# EAGLE design Sensor (EAGLE 7.2.0)
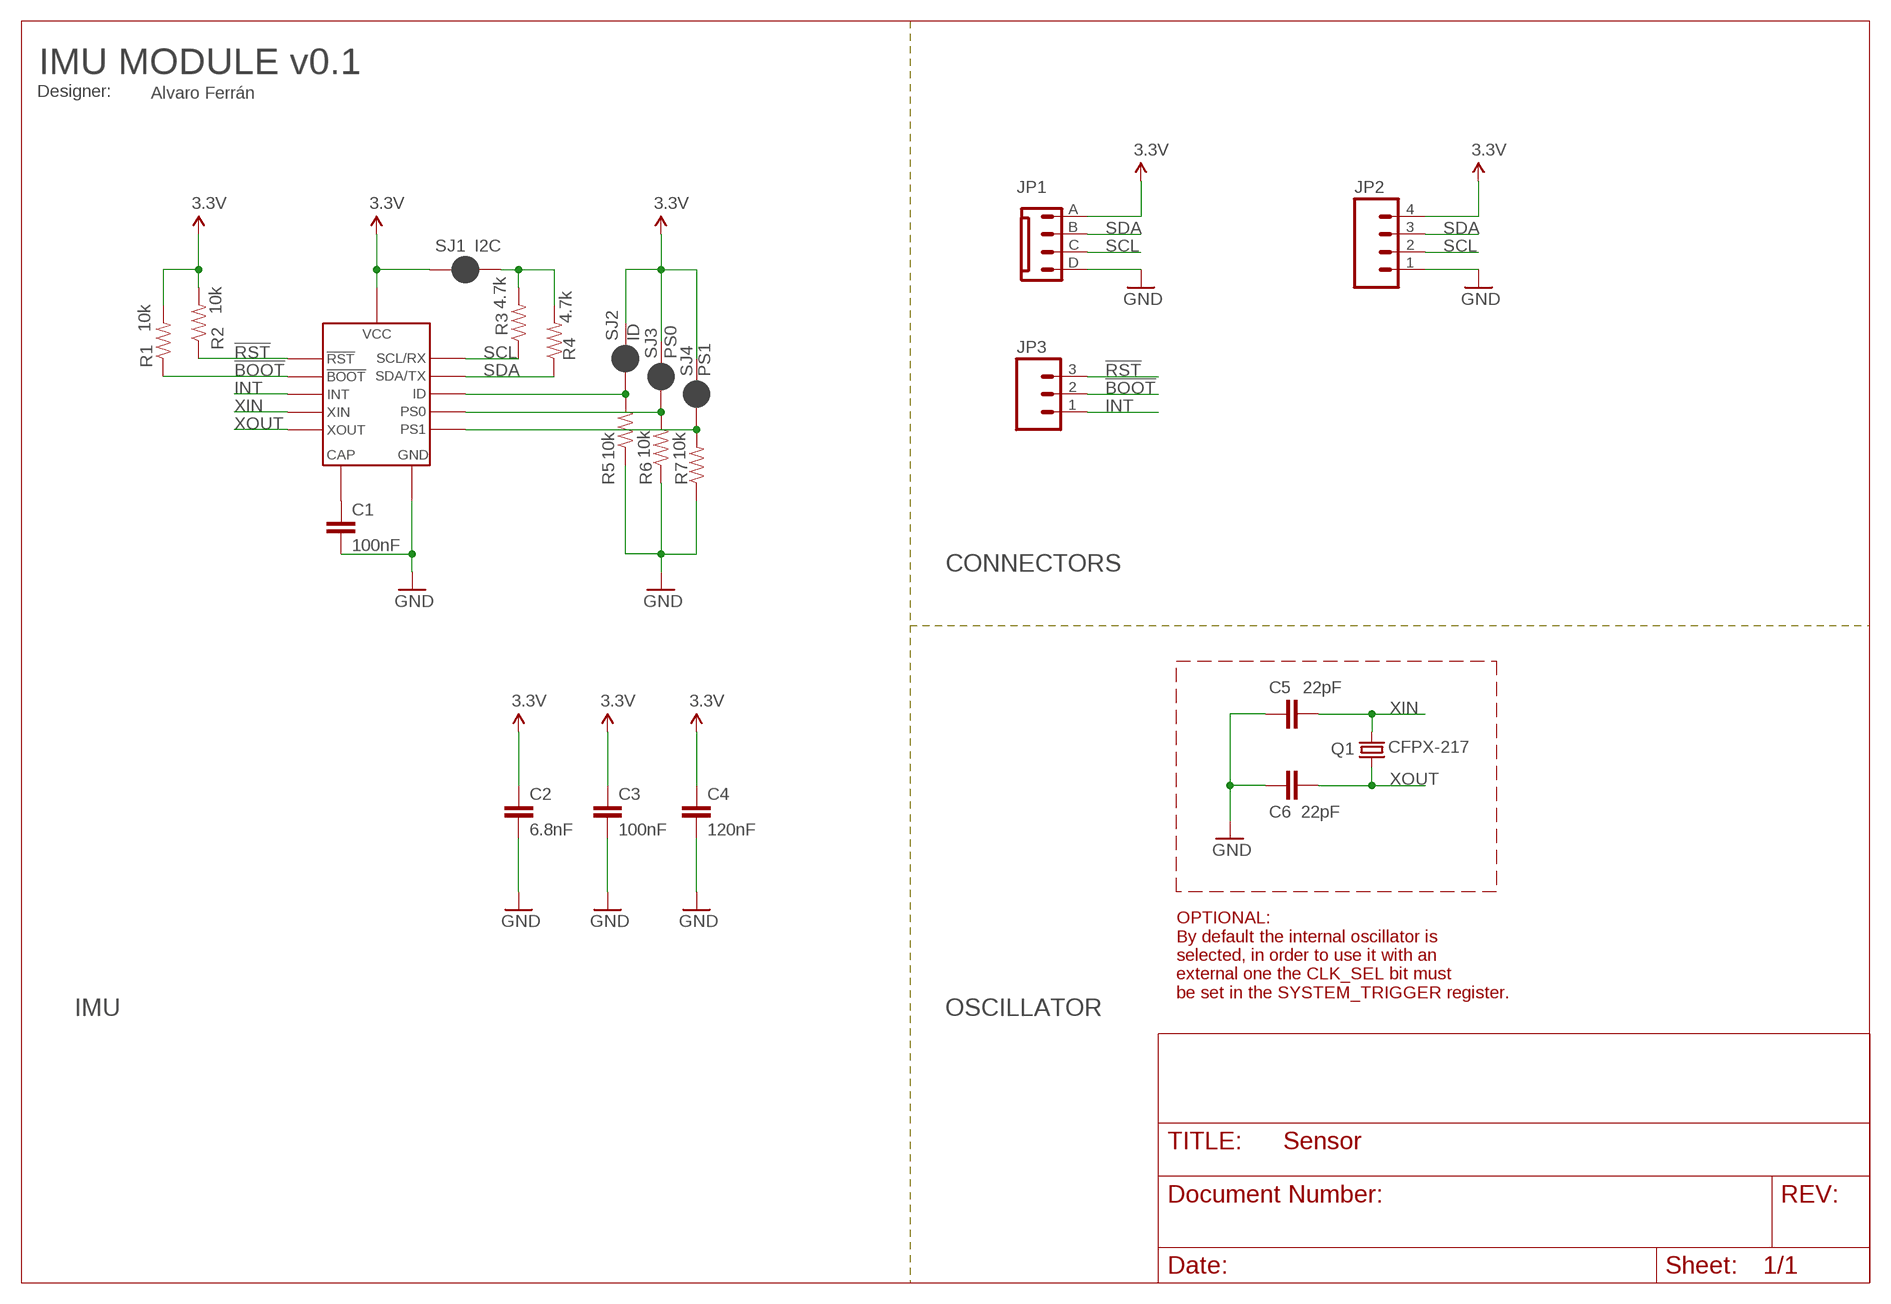
[diagram p0: schematic, sheet 1]

## Parts
C1  100nF  CAP0603-CAP  [0603-CAP]
C2  6.8nF  CAP0603-CAP  [0603-CAP]
C3  100nF  CAP0603-CAP  [0603-CAP]
C4  120nF  CAP0603-CAP  [0603-CAP]
C5  22pF  CAP0402-CAP  [0402-CAP]
C6  22pF  CAP0402-CAP  [0402-CAP]
JP1  MX-6410-04A  [MX-6410-04A]
JP2  M04LOCK  [1X04_LOCK]
JP3  M03LOCK  [1X03_LOCK]
Q1  CFPX-217  [CFPX-217]
R1  10k  RESISTOR0402-RES  [0402-RES]
R2  10k  RESISTOR0402-RES  [0402-RES]
R3  4.7k  RESISTOR0402-RES  [0402-RES]
R4  4.7k  RESISTOR0402-RES  [0402-RES]
R5  10k  RESISTOR0402-RES  [0402-RES]
R6  10k  RESISTOR0402-RES  [0402-RES]
R7  10k  RESISTOR0402-RES  [0402-RES]
SJ1  I2C  JUMPER-PAD-2-NC_BY_PASTE  [PAD-JUMPER-2-NC_BY_PASTE_YES_SILK]
SJ2  ID  JUMPER-PAD-2-NC_BY_PASTE  [PAD-JUMPER-2-NC_BY_PASTE_YES_SILK]
SJ3  PS0  JUMPER-PAD-2-NC_BY_PASTE  [PAD-JUMPER-2-NC_BY_PASTE_YES_SILK]
SJ4  PS1  JUMPER-PAD-2-NC_BY_PASTE  [PAD-JUMPER-2-NC_BY_PASTE_YES_SILK]
U1  BNO055  [BNO055]

## Nets
3.3V: C2.1 C3.1 C4.1 JP1.A JP2.4 R1.2 R2.2 SJ1.2 SJ2.2 SJ3.2 SJ4.2 U1.3(VCC) U1.28(VCC)
!BOOT: JP3.2 R1.1 U1.4(BOOT)
!RST: JP3.3 R2.1 U1.11(RST)
GND: C1.2 C2.2 C3.2 C4.2 C5.1 C6.1 JP1.D JP2.1 R5.1 R6.1 R7.1 U1.2(GND) U1.10(GND) U1.15(GND) U1.16(GND) U1.18(GND) U1.25(GND)
INT: JP3.1 U1.14(INT)
N$1: C1.1 U1.9(CAP)
N$2: R3.2 R4.2 SJ1.1
N$4: R5.2 SJ2.1 U1.17(ID)
N$5: R6.2 SJ3.1 U1.6(PS0)
N$6: R7.2 SJ4.1 U1.5(PS1)
SCL: JP1.C JP2.2 R3.1 U1.19(SCL/RX)
SDA: JP1.B JP2.3 R4.1 U1.20(SDA/TX)
XIN: C5.2 Q1.2 U1.27(XIN)
XOUT: C6.2 Q1.1 U1.26(XOUT)

## Notes on the sheet
- IMU MODULE v0.1
- Designer: | Alvaro Ferrán
- CONNECTORS
- OPTIONAL:
  By default the internal oscillator is
  selected, in order to use it with an
  external one the CLK_SEL bit must 
  be set in the SYSTEM_TRIGGER register.
- IMU | OSCILLATOR

## Library data of the parts
C1-C6 = SparkFun-Passives:CAP: Capacitor Standard 0603 ceramic capacitor, and 0.1" leaded capacitor.
JP1 = alvaroferran:MX-6410-04A: Locking molex connector ( http://www.tme.eu/en/details/mx-6410-04a/raster-signal-connectors-254mm/molex/0022272041-ae-6410-04a102/ )
JP2 = SparkFun-Connectors:M04: Header 4 Standard 4-pin 0.1" header. Use with straight break away headers (SKU : PRT-00116), right angle break away headers (PRT-00553), swiss pins (PRT-00743), machine pins (PRT-00117), and female headers (PRT-00115). Molex polarized connector foot print use with SKU : PRT-08231 with associated crimp pins and housings. 1MM SMD Version SKU: PRT-10208
JP3 = SparkFun-Connectors:M03: Header 3 Standard 3-pin 0.1" header. Use with straight break away headers (SKU : PRT-00116), right angle break away headers (PRT-00553), swiss pins (PRT-00743), machine pins (PRT-00117), and female headers (PRT-00115). Molex polarized connector foot print use with SKU : PRT-08232 with associated crimp pins and housings.
Q1 = alvaroferran:CFPX-217
R1-R7 = SparkFun-Passives:RESISTOR: Resistor Basic schematic elements and footprints for 0603, 1206, and PTH resistors.
SJ1-SJ4 = SparkFun-Passives:JUMPER-PAD-2-NC_BY_PASTE
U1 = alvaroferran:BNO055: The BNO055 is a System in Package (SiP), integrating a triaxial 14-bit accelerometer, a triaxial 16-bit gyroscope with a range of ±2000 degrees per second, a triaxial geomagnetic sensor and a 32-bit microcontroller running the company’s BSX3.0 FusionLib software. At just 5.2 x 3.8 x 1.1 mm3, it is significantly smaller than comparable discrete or system-on-board solutions.

## Net classes
0 default: width 0.254 mm, drill 0.254 mm, clearance 0.203 mm
1 power: width 0.61 mm, drill 0.61 mm, clearance 0.254 mm

## Board
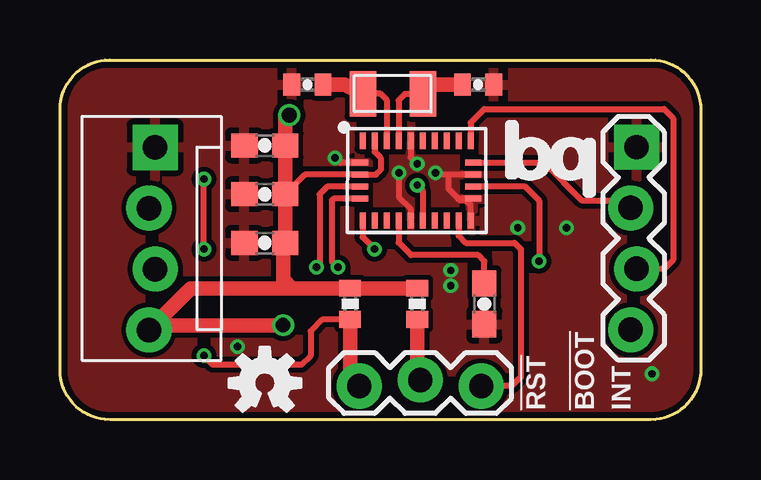
[diagram p1: board, top side]
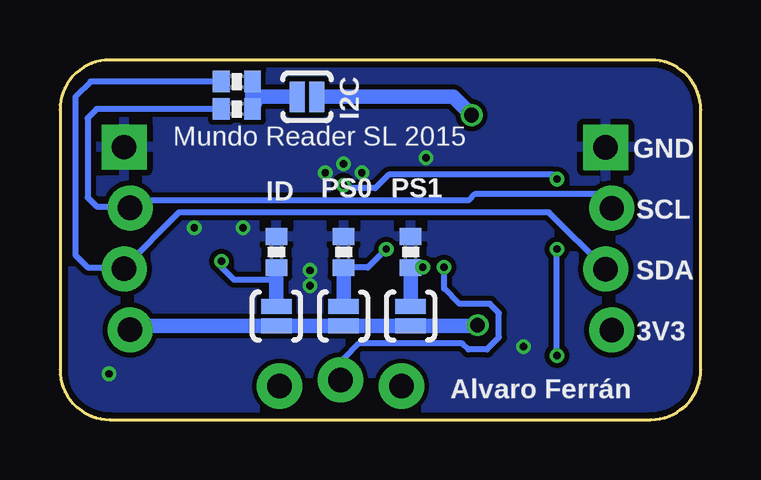
[diagram p2: board, bottom side, seen from below]

Size 26.7 x 15 mm. Coordinates in mm from the lower left corner, seen from the top.
Outline: 0,2.07 0,12.93 arc-90 2.07,15 24.62,15 arc-90 26.7,12.93 26.7,2.07 arc-90 24.62,0 2.07,0 arc-90 0,2.07
Copper layers (1*16): Top 0.035mm / dielectric 1.5mm / Bottom 0.035mm
Design rules "pighixxx_CAM_DRC_V1.0": minimum track width 6mil, minimum drill 12mil, track to track 6mil, track to pad 6mil, pad to pad 6mil, via to via 6mil, smd to smd 0mil, copper to edge 10mil, drill to drill 10mil, minimum pad ring 10mil, minimum via ring 6mil, stop-mask expansion 2mil, vias tented up to drill 100mil, thermal gap 10mil

### Footprints (pad centres in the part's own frame; a part is rotated, then mirrored left to right if it is on the bottom)
0603-CAP = smd 1.1 x 1: 1 -0.85,0; 2 0.85,0
0402-CAP = smd 0.7 x 0.9: 1 -0.65,0; 2 0.65,0
MX-6410-04A = drill 1.016 pad 1.88: A 8.9,2.797; B 6.36,3.051; C 3.82,2.797 | drill 1.016 pad 1.88 square: D 1.28,3.051
1X04_LOCK = drill 1.016 pad 1.88 square: 1 0,0.127 | drill 1.016 pad 1.88: 2 2.54,-0.127; 3 5.08,0.127; 4 7.62,-0.127
1X03_LOCK = drill 1.016 pad 1.88: 1 0,0.127; 2 2.54,-0.127; 3 5.08,0.127
CFPX-217 = smd 1.1 x 1.9: 1 -1.25,0; 2 1.25,0
0402-RES = smd 0.7 x 0.9: 1 -0.65,0; 2 0.65,0
PAD-JUMPER-2-NC_BY_PASTE_YES_SILK = smd 0.635 x 1.27: 1 -0.401,0; 2 0.413,0
BNO055 = smd 0.25 x 0.68: 1 -2.279,1.72; 6 -2.279,-1.606; 7 -1.779,-1.606; 8 -1.279,-1.606; 9 -0.779,-1.606; 10 -0.279,-1.606; 11 0.221,-1.606; 12 0.721,-1.606; 13 1.221,-1.606; 14 1.721,-1.606; 15 2.221,-1.606; 20 2.221,1.72; 21 1.721,1.72; 22 1.221,1.72; 23 0.721,1.72; 24 0.221,1.72; 25 -0.279,1.72; 26 -0.779,1.72; 27 -1.279,1.72; 28 -1.779,1.72 | smd 0.68 x 0.25: 2 -2.387,0.809; 3 -2.387,0.309; 4 -2.387,-0.191; 5 -2.387,-0.691; 16 2.332,-0.692; 17 2.332,-0.192; 18 2.332,0.308; 19 2.332,0.808

### Placement (x,y rotation side)
C1  17.68,4.83 270 top
C2  8.53,11.43 180 top
C3  8.53,9.4 180 top
C4  8.53,7.37 180 top
C5  10.31,13.97 0 top
C6  17.42,13.97 180 top
JP1  0.91,12.64 270 top
JP2  23.9,11.37 270 top
JP3  17.55,1.52 180 top
Q1  13.87,13.59 180 top
R1  14.88,4.83 90 top
R2  12.09,4.83 90 top
R3  19.33,12.95 0 bottom
R4  19.33,14.1 0 bottom
R5  17.68,6.98 270 bottom
R6  14.88,6.98 270 bottom
R7  12.09,6.98 270 bottom
SJ1  16.41,13.46 0 bottom
SJ2  17.68,4.32 270 bottom
SJ3  14.88,4.32 270 bottom
SJ4  12.09,4.32 270 bottom
U1  14.88,9.91 0 top
U$1  [BQ_LOGO_MEDIUM]  18.57,9.27 0 top
U$2  [OSHW-LOGO-S]  8.53,1.52 0 top

### Tracks (layer width: path | path; a pad name or v marks a point on that pad's centre or on a via)
3.3V  (via drill 0.61)
  Top 0.254: C3.1 10.2,10.21 U1.3 13.16,10.21 13.36,10.41 13.36,10.92 13.1,11.18 U1.28
  Top 0.61: 9.66,5.48 R2.2 R1.2 | 9.66,5.48 9.3,5.84 9.3,7.28 C4.1 C3.1 C2.1 9.38,12.53 v9.55,12.7 | 9.66,5.48 5.45,5.48 JP1.A 3.91,3.94 v9.3,3.94
  Bottom 0.61: SJ1.2 10.31,13.46 v9.55,12.7 | 3.88,3.9 JP1.A | v9.3,3.94 9.3,3.9 SJ4.2 SJ3.2 SJ2.2 23.61,3.9 JP2.4
!BOOT  (via drill 0.3)
  Top 0.254: v10.69,6.35 arc60 10.82,6.6 10.82,9.4 11.14,9.71 U1.4
  Top 0.61: R1.1 14.88,1.78 JP3.2
  Bottom 0.254: v10.69,6.35 10.69,5.46 10.06,4.83 8.79,4.83 8.41,4.44 8.41,3.43 8.91,2.92 9.68,2.92 9.93,3.17 14.25,3.17 14.88,2.54 14.88,1.78 JP3.2
!RST  (via drill 0.3)
  Top 0.254: R2.1 10.93,4.18 10.44,3.68 10.44,2.67 10.06,2.29 6.37,2.29 v5.99,2.67 | v5.99,7.11 v5.99,10.03 | v14.88,9.78 15.1,9.56 U1.11
  Top 0.61: R2.1 12.09,1.78 JP3.3
  Bottom 0.254: v5.99,2.67 v5.99,7.11 | v5.99,10.03 6.15,10.21 13,10.21 13.56,9.65 14.5,9.65 14.76,9.78 v14.88,9.78
GND  (via drill 0.3)
  Top 0.254: U1.15 17.1,8.95 16.92,9.14 16.66,9.14 16.73,9.21 U1.16 16.59,9.21 16.18,9.63 16.18,10.21 | U1.18 16.18,10.21 | 16.18,10.21 15.72,10.21 v15.65,10.29 | U1.25 14.6,10.95 v14.88,10.67 | U1.2 11.66,10.71 v11.45,10.92 | v14.12,10.29 14.12,9.27 14.6,8.79 U1.10
  other vias: 19.07,8 21.11,8 16.28,6.22 16.28,5.59 7.39,3.05 24.66,1.9
  pour Top: 26.82,14.99 26.82,-0.25 -0.36,-0.25 -0.36,14.99
  pour Bottom: 26.82,14.99 26.82,-0.25 -0.36,-0.25 -0.36,14.99
INT
  Top 0.254: JP3.1 18.82,1.4 19.2,1.78 19.2,7.11 18.95,7.37 16.92,7.37 16.6,7.68 U1.14
N$1
  Top 0.254: U1.9 14.1,7.38 14.63,6.86 17.42,6.86 17.68,6.6 C1.1
N$2
  Bottom 0.61: R4.2 R3.2 18.42,13.46 SJ1.1
N$4  (via drill 0.3)
  Top 0.254: v19.96,6.6 19.96,9.14 19.39,9.71 U1.17
  Bottom 0.254: v19.96,6.6 19.96,6.35 19.46,5.84 17.68,5.84
  Bottom 0.61: SJ2.1 17.68,5.84 R5.2
N$5  (via drill 0.3)
  Top 0.254: v13.11,7.11 12.6,7.61 U1.6
  Bottom 0.254: v13.11,7.11 13.88,6.33 R6.2
  Bottom 0.61: SJ3.1 R6.2
N$6  (via drill 0.3)
  Top 0.254: v11.58,6.35 11.33,6.6 11.33,9.14 11.4,9.21 U1.5
  Bottom 0.254: v11.58,6.35 12.07,6.35 R7.2
  Bottom 0.61: R7.2 SJ4.1
SCL
  Top 0.254: U1.19 20.17,10.71 21.74,9.14 23.46,9.14 JP2.2
  Bottom 0.254: JP1.C 4.29,9.4 9.42,9.4 9.68,9.14 23.46,9.14 JP2.2 23.84,8.89 25.17,8.89 25.55,9.27 25.55,12.57 25.17,12.95 R3.1
SDA
  Top 0.254: U1.20 17.1,12.38 17.68,12.95 25.17,12.95 25.55,12.57 25.55,6.66 25.18,6.29 JP2.3
  Bottom 0.254: JP1.B 6.32,8.64 21.74,8.64 24.03,6.35 JP2.3 24.09,6.35 25.55,6.35 26.06,6.86 26.06,13.46 25.42,14.1 R4.1
XIN
  Top 0.254: Q1.2 13.36,13.59 13.6,13.34 U1.27
  Top 0.61: C5.2 11.86,13.97 Q1.2
XOUT
  Top 0.254: Q1.1 14.38,13.59 14.1,13.32 U1.26
  Top 0.61: C6.2 15.37,13.97 Q1.1

### Text on the board
tPlace: !RST | !BOOT | INT
bPlace: Mundo Reader SL 2015 | GND | SCL | SDA | 3V3 | Alvaro Ferrán